# Altium schematic sheet 01_Block_Diagram.SchDoc
size A4; CheckedBy: Doo; Author: Doo; DocumentNumber: PIF_C24_VRS02; Revision: RV_01; SheetNumber: 2; SheetTotal: 7
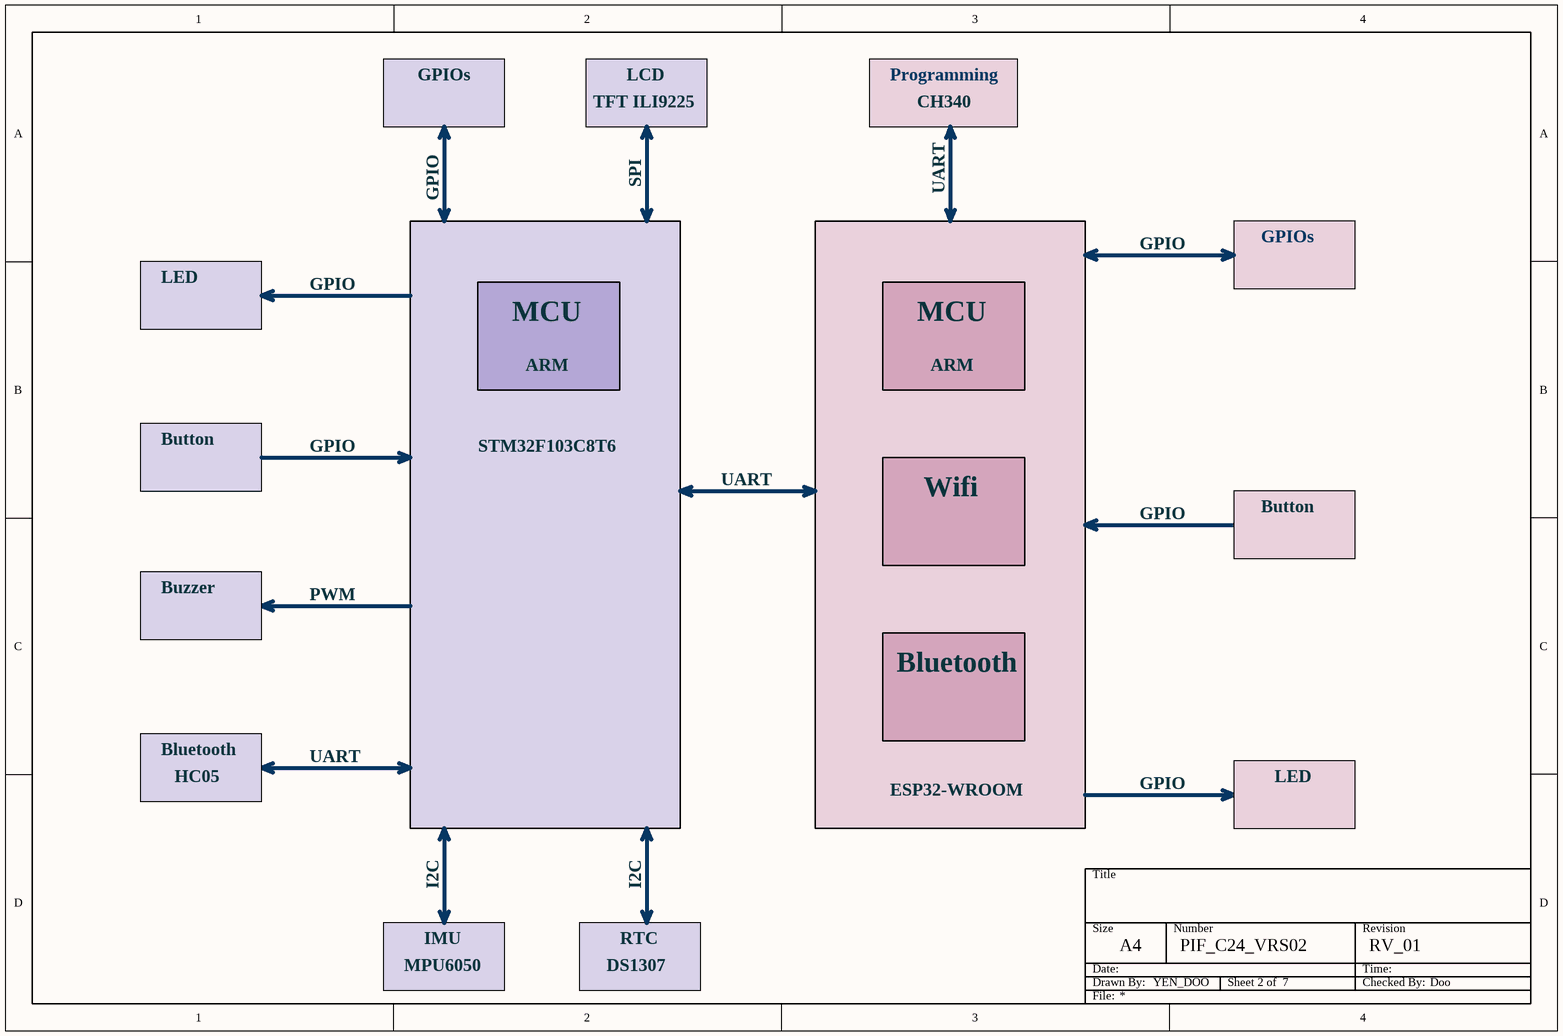
[diagram p0: 01_Block_Diagram.SchDoc]

## Notes on the sheet
- GPIOs
- TFT ILI9225
- LCD
- Programming
- CH340
- GPIO
- SPI
- UART
- LED
- MCU
- ARM
- Button
- STM32F103C8T6
- Wifi
- Buzzer
- PWM
- Bluetooth
- HC05
- ESP32-WROOM
- I2C
- MPU6050
- IMU
- DS1307
- RTC
- Title
- Size
- Date:
- Drawn By:
- A4
- YEN_DOO
- Number
- Revision
- Checked By:
- Time:
- File: